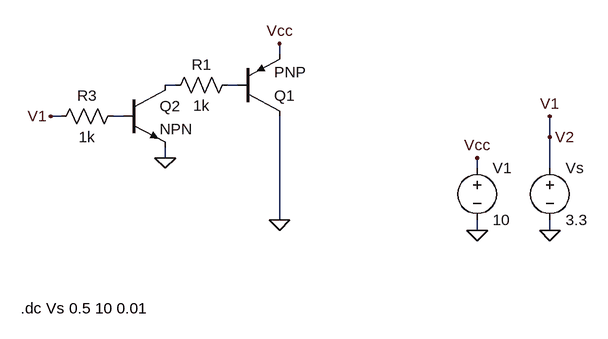
[diagram p0: schematic Draft4.asc]
Draft4.asc, the LTspice schematic file:
Version 4
SHEET 1 1176 680
WIRE 192 96 192 80
WIRE 32 144 16 144
WIRE 128 144 112 144
WIRE -144 192 -160 192
WIRE -48 192 -64 192
WIRE 608 224 608 192
WIRE 16 256 16 240
WIRE 496 272 496 256
WIRE 608 272 608 224
WIRE 192 352 192 192
WIRE 496 368 496 352
WIRE 608 368 608 352
FLAG 16 256 0
FLAG 496 368 0
FLAG 496 256 Vcc
FLAG 192 80 Vcc
FLAG -160 192 V1
FLAG 608 192 V1
FLAG 608 224 V2
FLAG 608 368 0
FLAG 192 352 0
SYMBOL res 128 128 R90
WINDOW 0 0 56 VBottom 2
WINDOW 3 32 56 VTop 2
SYMATTR InstName R1
SYMATTR Value 1k
SYMBOL res -48 176 R90
WINDOW 0 0 56 VBottom 2
WINDOW 3 32 56 VTop 2
SYMATTR InstName R3
SYMATTR Value 1k
SYMBOL voltage 496 256 R0
WINDOW 123 0 0 Left 0
WINDOW 39 0 0 Left 0
SYMATTR InstName V1
SYMATTR Value 10
SYMBOL voltage 608 256 R0
WINDOW 123 0 0 Left 0
WINDOW 39 0 0 Left 0
SYMATTR InstName Vs
SYMATTR Value 3.3
SYMBOL pnp 128 192 M180
SYMATTR InstName Q1
SYMBOL npn -48 144 R0
SYMATTR InstName Q2
TEXT -206 488 Left 2 !.dc Vs 0.5 10 0.01

The netlist it stands for:
* Draft4.asc
R1 N002 N001 1k
R3 N003 V2 1k
V1 Vcc 0 10
Vs V2 0 3.3
Q1 0 N002 Vcc 0 PNP
Q2 N001 N003 0 0 NPN
.model NPN NPN
.model PNP PNP
.lib standard.bjt
.dc Vs 0.5 10 0.01
.backanno
.end